# Altium schematic sheet Ethernet.SchDoc
size A3; SheetNumber: 2; SheetTotal: 8; SPICEModelCacheVAZTWSEG: <root> / <DocumentId>VAZTWSEG</DocumentId> / <CacheFrame Number="0"> / <Model Name="cap" Kind="MDL"> / <Text>*Default semiconductor capacitor / .MODEL CAP C()</Text> / </Model> / </CacheFrame> / </root>
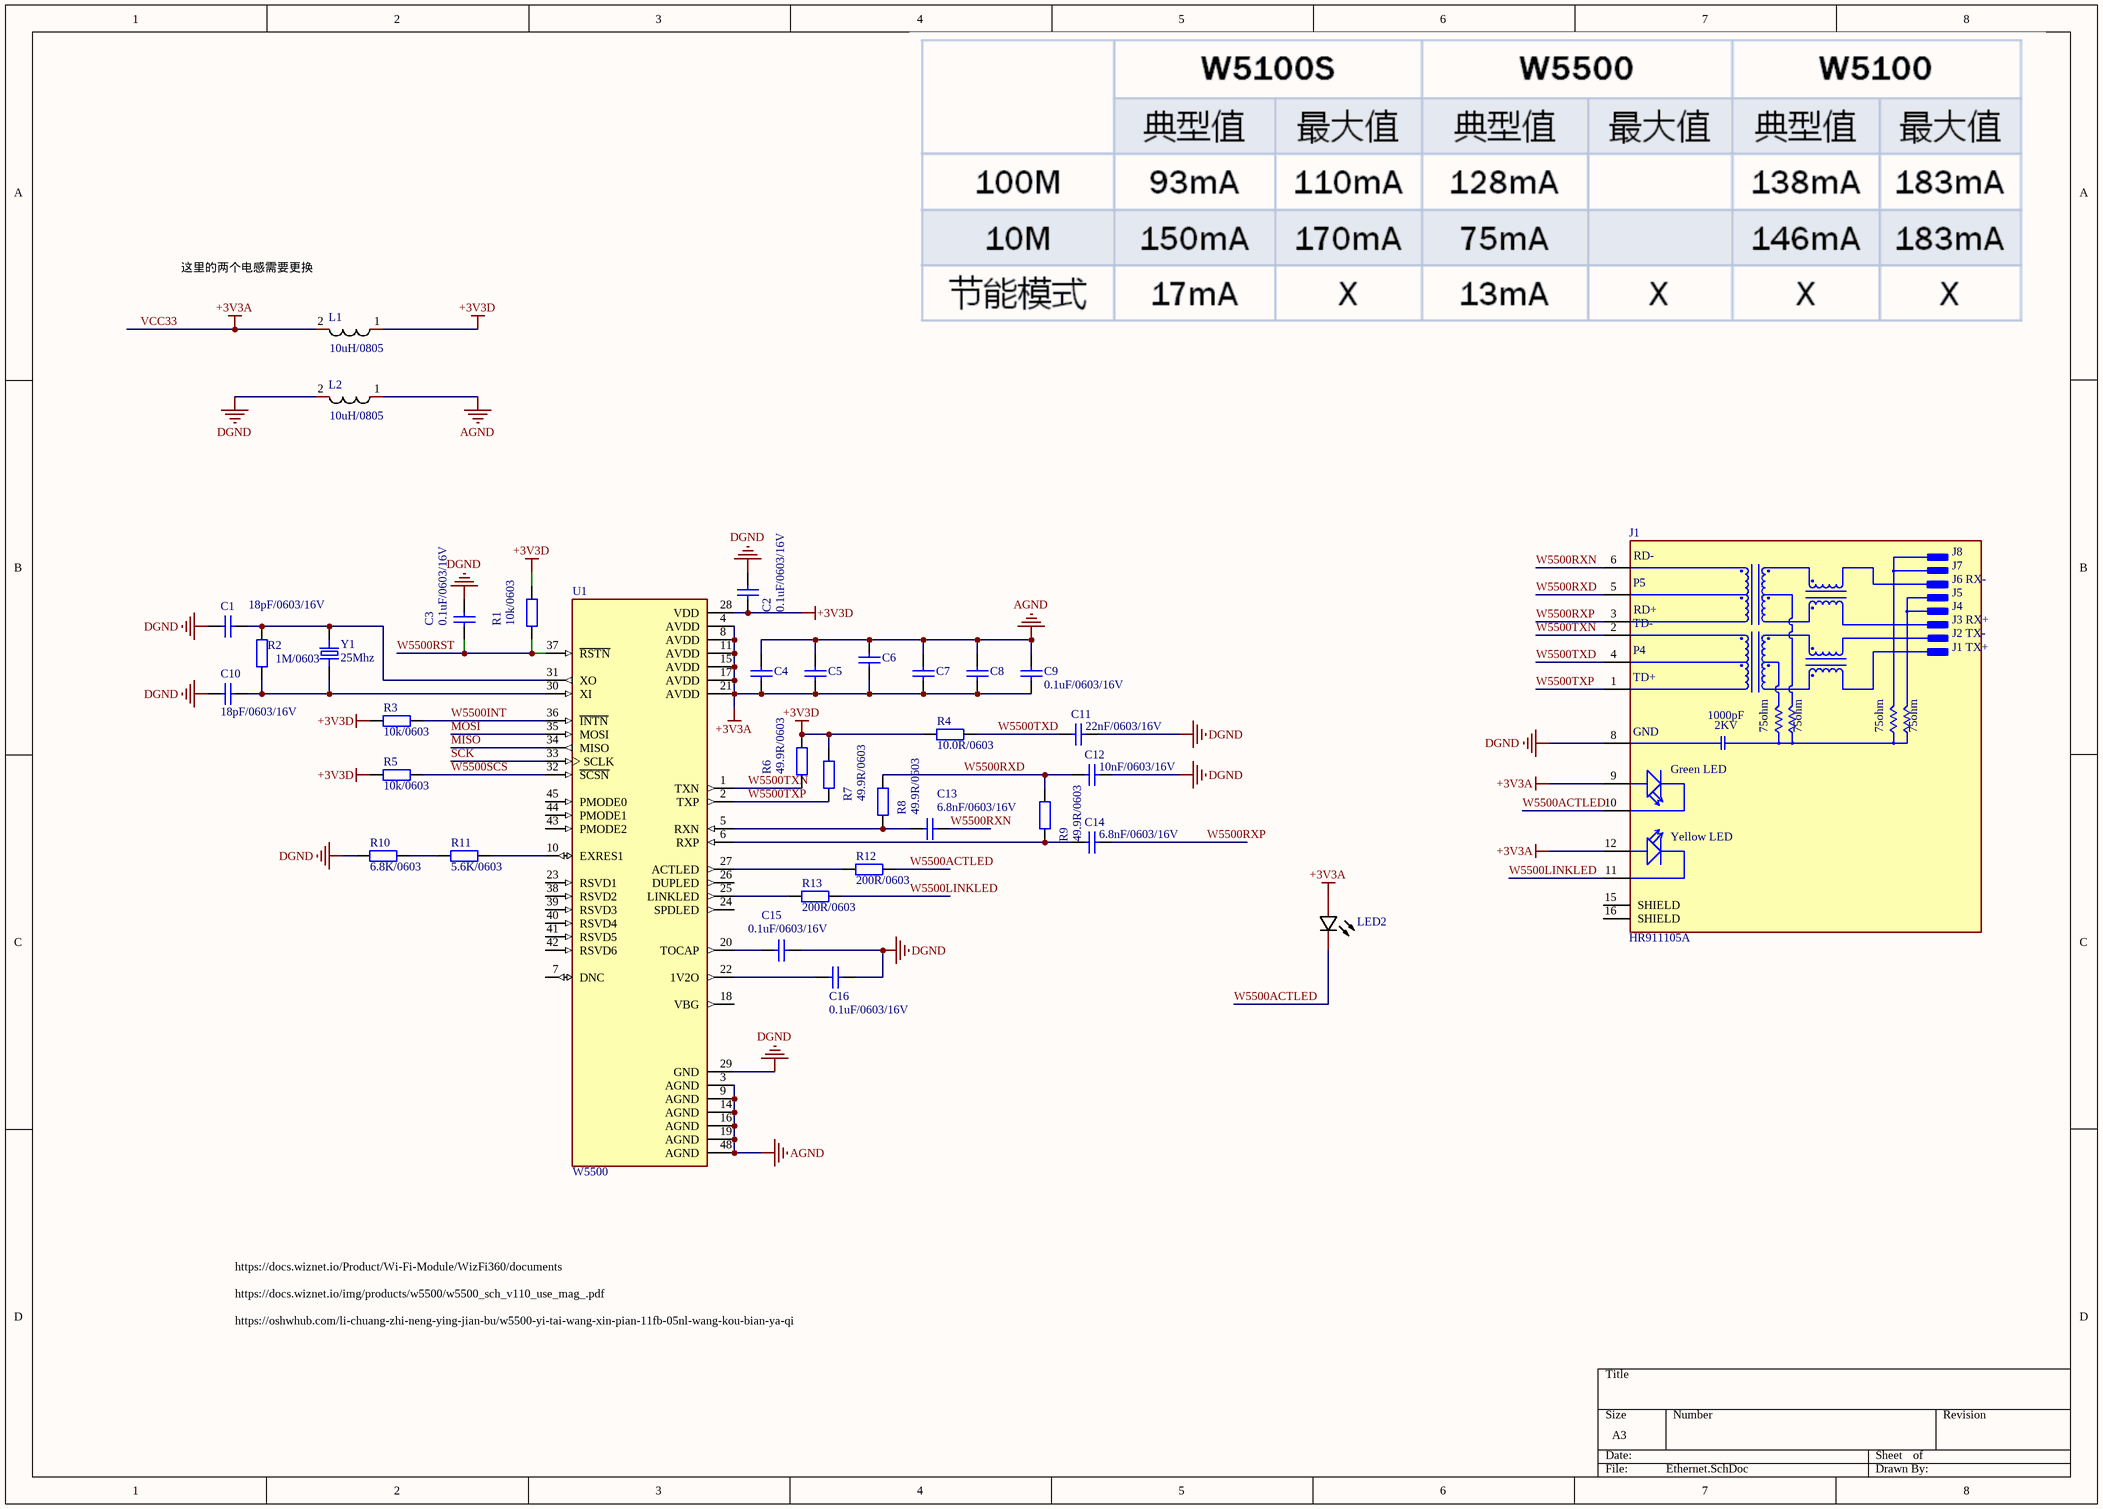
[diagram p0: Ethernet.SchDoc]

## Parts
C1  18pF/0603/16V  [CAP0603]
C2  0.1uF/0603/16V  [CAP0603]
C3  0.1uF/0603/16V  [CAP0603]
C4  0.1uF/0603/16V  [CAP0603]  (value not drawn)
C5  0.1uF/0603/16V  [CAP0603]  (value not drawn)
C6  0.1uF/0603/16V  [CAP0603]  (value not drawn)
C7  0.1uF/0603/16V  [CAP0603]  (value not drawn)
C8  0.1uF/0603/16V  [CAP0603]  (value not drawn)
C9  0.1uF/0603/16V  [CAP0603]
C10  18pF/0603/16V  [CAP0603]
C11  22nF/0603/16V  [CAP0603]
C12  10nF/0603/16V  [CAP0603]
C13  6.8nF/0603/16V  [CAP0603]
C14  6.8nF/0603/16V  [CAP0603]
C15  0.1uF/0603/16V  [CAP0603]
C16  0.1uF/0603/16V  [CAP0603]
J1  HR911105A  [HANRUN_HR911105A]
L1  10uH/0805  [RES0805]
L2  10uH/0805  [RES0805]
LED2  19-217/GHC-YR1S2/3T  [LED_0603_KA]  (value not drawn)
R1  10k/0603  [R0603]
R2  1M/0603  [R0603]
R3  10k/0603  [R0603]
R4  10.0R/0603  [R0603]
R5  10k/0603  [R0603]
R6  49.9R/0603  [R0603]
R7  49.9R/0603  [R0603]
R8  49.9R/0603  [R0603]
R9  49.9R/0603  [R0603]
R10  6.8K/0603  [R0603]
R11  5.6K/0603  [R0603]
R12  200R/0603  [R0603]
R13  200R/0603  [R0603]
U1  W5500  [W5500-LQFP50P900X900X160-48N]
Y1  25Mhz  [XTAL_ECS-250-20-4X-F-DN]

## Nets
+3V3D: C2.2 L1.1 R1.2 R3.2 R4.2 R5.2 R6.2 R7.2 U1.28(VDD)
AGND: C4.2 C5.2 C6.2 C7.2 C8.2 C9.2 L2.1 U1.3(AGND) U1.9(AGND) U1.14(AGND) U1.16(AGND) U1.19(AGND) U1.48(AGND)
DGND: C1.1 C2.1 C3.2 C10.1 C11.2 C12.2 C15.1 C16.1 J1.8(GND) L2.2 R10.2 U1.29(GND)
VCC33: C4.1 C5.1 C6.1 C7.1 C8.1 C9.1 J1.9(GA) J1.12(YA) L1.2 LED2.1(A) U1.4(AVDD) U1.8(AVDD) U1.11(AVDD) U1.15(AVDD) U1.17(AVDD) U1.21(AVDD)  [also labelled +3V3A]
MISO: U1.34(MISO)
MOSI: U1.35(MOSI)
SCK: U1.33(SCLK)
W5500ACTLED: J1.10(GC) LED2.2(C) R12.1
W5500INT: R3.1 U1.36(~{INTN})
W5500LINKLED: J1.11(YC) R13.1
W5500RST: C3.1 R1.1 U1.37(~{RSTN})
W5500RXD: C12.1 J1.5(P5) R8.2 R9.2
W5500RXN: C13.2 J1.6(RD-)
W5500RXP: C14.2 J1.3(RD+)
W5500SCS: R5.1 U1.32(~{SCSN})
W5500TXD: C11.1 J1.4(P4) R4.1
W5500TXN: J1.2(TD-) R6.1 U1.1(TXN)
W5500TXP: J1.1(TD+) R7.1 U1.2(TXP)
NetC1_2: C1.2 R2.2 U1.31(XO) Y1.2
NetC10_2: C10.2 R2.1 U1.30(XI) Y1.1
NetC13_1: C13.1 R8.1 U1.5(RXN)
NetC14_1: C14.1 R9.1 U1.6(RXP)
NetC15_2: C15.2 U1.20(TOCAP)
NetC16_2: C16.2 U1.22(1V2O)
NetR10_1: R10.1 R11.2
NetR11_1: R11.1 U1.10(EXRES1)
NetR12_2: R12.2 U1.27(ACTLED)
NetR13_2: R13.2 U1.25(LINKLED)

Not connected (* = marked no-connect by the designer): J1 15(SHIELD) 16(SHIELD); U1 7(DNC) 18(VBG) 23(RSVD1) 24(SPDLED) 26(DUPLED) 38(RSVD2) 39(RSVD3) 40(RSVD4) 41(RSVD5) 42(RSVD6) 43(PMODE2) 44(PMODE1) 45(PMODE0)

## Notes on the sheet
- 这里的两个电感需要更换
- https://docs.wiznet.io/img/products/w5500/w5500_sch_v110_use_mag_.pdf
- https://docs.wiznet.io/Product/Wi-Fi-Module/WizFi360/documents
- https://oshwhub.com/li-chuang-zhi-neng-ying-jian-bu/w5500-yi-tai-wang-xin-pian-11fb-05nl-wang-kou-bian-ya-qi
- (in symbol HR911105A) J8; J7; J6 RX-; J5; J4; J3 RX+; J2 TX-; J1 TX+; 1000pF; 2KV; 75ohm; Green LED; Yellow LED

## Library data of the parts
C1-C16 = Cap Semi: Capacitor (Semiconductor SIM Model); Published: 8-Jun-2000; LatestRevisionDate: 29-May-2009; LatestRevisionNote: IPC-7351 Footprint Added.; PackageReference: C1206; Publisher: Altium Limited; PackageDescription: Chip Capacitor
L1 L2 = IND-MOLDED: Sim_Analog_Order: Model$; Sim_Analog_Prefix: L; Description" MOLDED INDUCTOR, 0_5: PIN SPACING; Value: 10uH; PCB DECAL: L_0650; Add into BOM: yes; Name: IND-MOLDED; Symbol: IND-MOLDED; Device: IND-MOLDED; OldName: IND-MOLDED; Convert to PCB: yes; Origin Footprint: L_0650
LED2 = 19-217/GHC-YR1S2/3T: Manufacturer: EVERLIGHT; Convert to PCB: yes; Origin Footprint: LED0603-R-RD; Name: 19-217/GHC-YR1S2/3T; Symbol: 19-217/GHC-YR1S2/3T; Device: 19-217/GHC-YR1S2/3T; Supplier: LCSC; Manufacturer Part: 19-217/GHC-YR1S2/3T; Supplier Part: C72043; JLCPCB Part Class: Basic Part; Add into BOM: yes
R1-R13 = Res2: Resistor; Value: 1K; Published: 8-Jun-2000; LatestRevisionDate: 17-Jul-2002; LatestRevisionNote: Re-released for DXP Platform.; PackageReference: AXIAL-0.4; Publisher: Altium Limited; PackageDescription: Axial Device, Thru-Hole; 2 Leads; 0.4 in Pin Spacing
Y1 = 25Mhz-ECS-250-20-4X-F-DN: 25 MHz ±30ppm Crystal 20pF 30 Ohms HC-49/US; MF: ECS Inc.; SnapEDA_Link: https://www.snapeda.com/parts/ECS-250-20-4X-F-DN/ECS+Inc./view-part/?ref=snap; Package: HC-49US ECS Inc.; Value: *; MP: ECS-250-20-4X-F-DN; Check_prices: https://www.snapeda.com/parts/ECS-250-20-4X-F-DN/ECS+Inc./view-part/?ref=eda